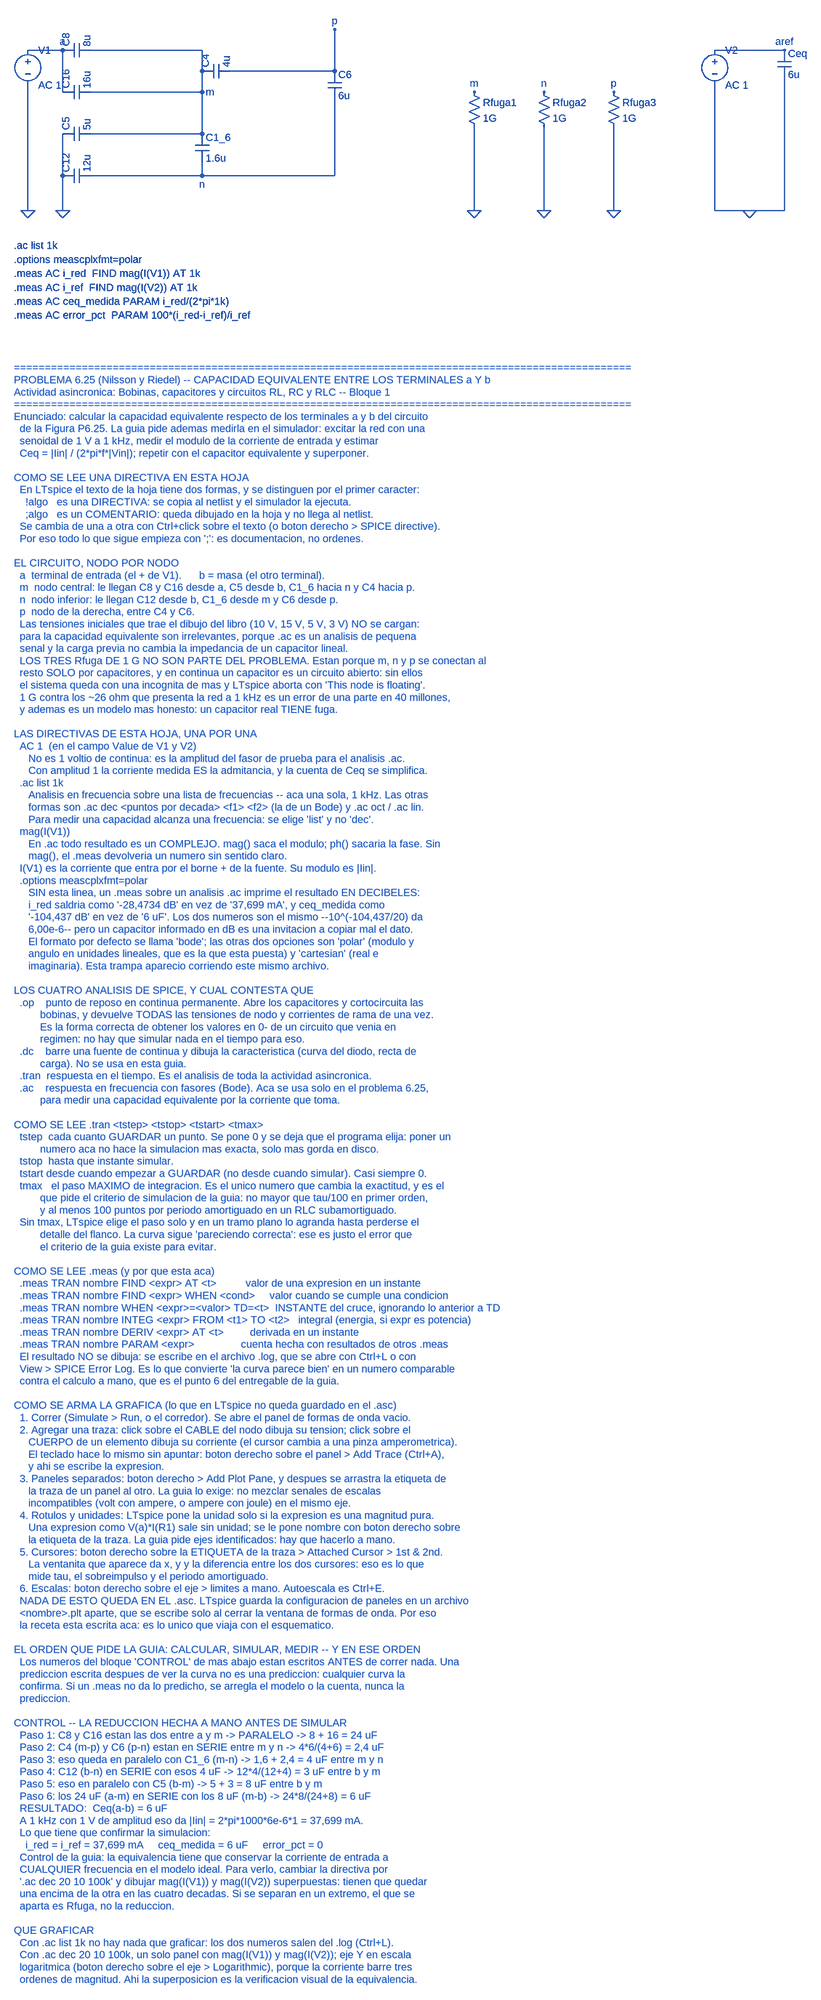
[diagram p0: schematic P6-25_capacidad_equivalente.asc]
P6-25_capacidad_equivalente.asc, the LTspice schematic file:
Version 4
SHEET 1 2400 2800
WIRE 96 112 176 112
WIRE 96 192 96 480
WIRE 240 112 496 112
WIRE 240 208 496 208
WIRE 176 112 176 208
WIRE 240 304 496 304
WIRE 240 400 496 400
WIRE 176 304 176 400
WIRE 176 400 176 480
WIRE 496 112 496 304
WIRE 496 368 496 400
WIRE 560 160 800 160
WIRE 800 224 800 400
WIRE 800 160 800 64
WIRE 800 400 496 400
WIRE 1120 288 1120 480
WIRE 1280 288 1280 480
WIRE 1440 288 1440 480
WIRE 1760 112 1920 112
WIRE 1760 192 1760 480
WIRE 1920 176 1920 480
WIRE 1760 480 1920 480
FLAG 96 480 0
FLAG 176 480 0
FLAG 176 112 a
FLAG 496 208 m
FLAG 496 400 n
FLAG 800 64 p
FLAG 1120 208 m
FLAG 1120 480 0
FLAG 1280 208 n
FLAG 1280 480 0
FLAG 1440 208 p
FLAG 1440 480 0
FLAG 1840 480 0
FLAG 1920 112 aref
SYMBOL voltage 96 96 R0
WINDOW 123 0 0 Left 0
WINDOW 39 0 0 Left 0
SYMATTR InstName V1
SYMATTR Value AC 1
SYMBOL cap 176 128 R270
SYMATTR InstName C8
SYMATTR Value 8u
SYMBOL cap 176 224 R270
SYMATTR InstName C16
SYMATTR Value 16u
SYMBOL cap 176 320 R270
SYMATTR InstName C5
SYMATTR Value 5u
SYMBOL cap 176 416 R270
SYMATTR InstName C12
SYMATTR Value 12u
SYMBOL cap 480 304 R0
SYMATTR InstName C1_6
SYMATTR Value 1.6u
SYMBOL cap 496 176 R270
SYMATTR InstName C4
SYMATTR Value 4u
SYMBOL cap 784 160 R0
SYMATTR InstName C6
SYMATTR Value 6u
SYMBOL res 1104 192 R0
SYMATTR InstName Rfuga1
SYMATTR Value 1G
SYMBOL res 1264 192 R0
SYMATTR InstName Rfuga2
SYMATTR Value 1G
SYMBOL res 1424 192 R0
SYMATTR InstName Rfuga3
SYMATTR Value 1G
SYMBOL voltage 1760 96 R0
WINDOW 123 0 0 Left 0
WINDOW 39 0 0 Left 0
SYMATTR InstName V2
SYMATTR Value AC 1
SYMBOL cap 1904 112 R0
SYMATTR InstName Ceq
SYMATTR Value 6u
TEXT 64 560 Left 2 !.ac list 1k
TEXT 64 592 Left 2 !.options meascplxfmt=polar
TEXT 64 624 Left 2 !.meas AC i_red  FIND mag(I(V1)) AT 1k
TEXT 64 656 Left 2 !.meas AC i_ref  FIND mag(I(V2)) AT 1k
TEXT 64 688 Left 2 !.meas AC ceq_medida PARAM i_red/(2*pi*1k)
TEXT 64 720 Left 2 !.meas AC error_pct  PARAM 100*(i_red-i_ref)/i_ref
TEXT 64 1000 Left 2 ;====================================================================================================
TEXT 64 1028 Left 2 ;PROBLEMA 6.25 (Nilsson y Riedel) -- CAPACIDAD EQUIVALENTE ENTRE LOS TERMINALES a Y b
TEXT 64 1056 Left 2 ;Actividad asincronica: Bobinas, capacitores y circuitos RL, RC y RLC -- Bloque 1
TEXT 64 1084 Left 2 ;====================================================================================================
TEXT 64 1112 Left 2 ;Enunciado: calcular la capacidad equivalente respecto de los terminales a y b del circuito
TEXT 64 1140 Left 2 ;  de la Figura P6.25. La guia pide ademas medirla en el simulador: excitar la red con una
TEXT 64 1168 Left 2 ;  senoidal de 1 V a 1 kHz, medir el modulo de la corriente de entrada y estimar
TEXT 64 1196 Left 2 ;  Ceq = |Iin| / (2*pi*f*|Vin|); repetir con el capacitor equivalente y superponer.
TEXT 64 1224 Left 2 ;
TEXT 64 1252 Left 2 ;COMO SE LEE UNA DIRECTIVA EN ESTA HOJA
TEXT 64 1280 Left 2 ;  En LTspice el texto de la hoja tiene dos formas, y se distinguen por el primer caracter:
TEXT 64 1308 Left 2 ;    !algo   es una DIRECTIVA: se copia al netlist y el simulador la ejecuta.
TEXT 64 1336 Left 2 ;    ;algo   es un COMENTARIO: queda dibujado en la hoja y no llega al netlist.
TEXT 64 1364 Left 2 ;  Se cambia de una a otra con Ctrl+click sobre el texto (o boton derecho > SPICE directive).
TEXT 64 1392 Left 2 ;  Por eso todo lo que sigue empieza con ';': es documentacion, no ordenes.
TEXT 64 1420 Left 2 ;
TEXT 64 1448 Left 2 ;EL CIRCUITO, NODO POR NODO
TEXT 64 1476 Left 2 ;  a  terminal de entrada (el + de V1).      b = masa (el otro terminal).
TEXT 64 1504 Left 2 ;  m  nodo central: le llegan C8 y C16 desde a, C5 desde b, C1_6 hacia n y C4 hacia p.
TEXT 64 1532 Left 2 ;  n  nodo inferior: le llegan C12 desde b, C1_6 desde m y C6 desde p.
TEXT 64 1560 Left 2 ;  p  nodo de la derecha, entre C4 y C6.
TEXT 64 1588 Left 2 ;  Las tensiones iniciales que trae el dibujo del libro (10 V, 15 V, 5 V, 3 V) NO se cargan:
TEXT 64 1616 Left 2 ;  para la capacidad equivalente son irrelevantes, porque .ac es un analisis de pequena
TEXT 64 1644 Left 2 ;  senal y la carga previa no cambia la impedancia de un capacitor lineal.
TEXT 64 1672 Left 2 ;  LOS TRES Rfuga DE 1 G NO SON PARTE DEL PROBLEMA. Estan porque m, n y p se conectan al
TEXT 64 1700 Left 2 ;  resto SOLO por capacitores, y en continua un capacitor es un circuito abierto: sin ellos
TEXT 64 1728 Left 2 ;  el sistema queda con una incognita de mas y LTspice aborta con 'This node is floating'.
TEXT 64 1756 Left 2 ;  1 G contra los ~26 ohm que presenta la red a 1 kHz es un error de una parte en 40 millones,
TEXT 64 1784 Left 2 ;  y ademas es un modelo mas honesto: un capacitor real TIENE fuga.
TEXT 64 1812 Left 2 ;
TEXT 64 1840 Left 2 ;LAS DIRECTIVAS DE ESTA HOJA, UNA POR UNA
TEXT 64 1868 Left 2 ;  AC 1  (en el campo Value de V1 y V2)
TEXT 64 1896 Left 2 ;     No es 1 voltio de continua: es la amplitud del fasor de prueba para el analisis .ac.
TEXT 64 1924 Left 2 ;     Con amplitud 1 la corriente medida ES la admitancia, y la cuenta de Ceq se simplifica.
TEXT 64 1952 Left 2 ;  .ac list 1k
TEXT 64 1980 Left 2 ;     Analisis en frecuencia sobre una lista de frecuencias -- aca una sola, 1 kHz. Las otras
TEXT 64 2008 Left 2 ;     formas son .ac dec <puntos por decada> <f1> <f2> (la de un Bode) y .ac oct / .ac lin.
TEXT 64 2036 Left 2 ;     Para medir una capacidad alcanza una frecuencia: se elige 'list' y no 'dec'.
TEXT 64 2064 Left 2 ;  mag(I(V1))
TEXT 64 2092 Left 2 ;     En .ac todo resultado es un COMPLEJO. mag() saca el modulo; ph() sacaria la fase. Sin
TEXT 64 2120 Left 2 ;     mag(), el .meas devolveria un numero sin sentido claro.
TEXT 64 2148 Left 2 ;  I(V1) es la corriente que entra por el borne + de la fuente. Su modulo es |Iin|.
TEXT 64 2176 Left 2 ;  .options meascplxfmt=polar
TEXT 64 2204 Left 2 ;     SIN esta linea, un .meas sobre un analisis .ac imprime el resultado EN DECIBELES:
TEXT 64 2232 Left 2 ;     i_red saldria como '-28,4734 dB' en vez de '37,699 mA', y ceq_medida como
TEXT 64 2260 Left 2 ;     '-104,437 dB' en vez de '6 uF'. Los dos numeros son el mismo --10^(-104,437/20) da
TEXT 64 2288 Left 2 ;     6,00e-6-- pero un capacitor informado en dB es una invitacion a copiar mal el dato.
TEXT 64 2316 Left 2 ;     El formato por defecto se llama 'bode'; las otras dos opciones son 'polar' (modulo y
TEXT 64 2344 Left 2 ;     angulo en unidades lineales, que es la que esta puesta) y 'cartesian' (real e
TEXT 64 2372 Left 2 ;     imaginaria). Esta trampa aparecio corriendo este mismo archivo.
TEXT 64 2400 Left 2 ;
TEXT 64 2428 Left 2 ;LOS CUATRO ANALISIS DE SPICE, Y CUAL CONTESTA QUE
TEXT 64 2456 Left 2 ;  .op    punto de reposo en continua permanente. Abre los capacitores y cortocircuita las
TEXT 64 2484 Left 2 ;         bobinas, y devuelve TODAS las tensiones de nodo y corrientes de rama de una vez.
TEXT 64 2512 Left 2 ;         Es la forma correcta de obtener los valores en 0- de un circuito que venia en
TEXT 64 2540 Left 2 ;         regimen: no hay que simular nada en el tiempo para eso.
TEXT 64 2568 Left 2 ;  .dc    barre una fuente de continua y dibuja la caracteristica (curva del diodo, recta de
TEXT 64 2596 Left 2 ;         carga). No se usa en esta guia.
TEXT 64 2624 Left 2 ;  .tran  respuesta en el tiempo. Es el analisis de toda la actividad asincronica.
TEXT 64 2652 Left 2 ;  .ac    respuesta en frecuencia con fasores (Bode). Aca se usa solo en el problema 6.25,
TEXT 64 2680 Left 2 ;         para medir una capacidad equivalente por la corriente que toma.
TEXT 64 2708 Left 2 ;
TEXT 64 2736 Left 2 ;COMO SE LEE .tran <tstep> <tstop> <tstart> <tmax>
TEXT 64 2764 Left 2 ;  tstep  cada cuanto GUARDAR un punto. Se pone 0 y se deja que el programa elija: poner un
TEXT 64 2792 Left 2 ;         numero aca no hace la simulacion mas exacta, solo mas gorda en disco.
TEXT 64 2820 Left 2 ;  tstop  hasta que instante simular.
TEXT 64 2848 Left 2 ;  tstart desde cuando empezar a GUARDAR (no desde cuando simular). Casi siempre 0.
TEXT 64 2876 Left 2 ;  tmax   el paso MAXIMO de integracion. Es el unico numero que cambia la exactitud, y es el
TEXT 64 2904 Left 2 ;         que pide el criterio de simulacion de la guia: no mayor que tau/100 en primer orden,
TEXT 64 2932 Left 2 ;         y al menos 100 puntos por periodo amortiguado en un RLC subamortiguado.
TEXT 64 2960 Left 2 ;  Sin tmax, LTspice elige el paso solo y en un tramo plano lo agranda hasta perderse el
TEXT 64 2988 Left 2 ;         detalle del flanco. La curva sigue 'pareciendo correcta': ese es justo el error que
TEXT 64 3016 Left 2 ;         el criterio de la guia existe para evitar.
TEXT 64 3044 Left 2 ;
TEXT 64 3072 Left 2 ;COMO SE LEE .meas (y por que esta aca)
TEXT 64 3100 Left 2 ;  .meas TRAN nombre FIND <expr> AT <t>          valor de una expresion en un instante
TEXT 64 3128 Left 2 ;  .meas TRAN nombre FIND <expr> WHEN <cond>     valor cuando se cumple una condicion
TEXT 64 3156 Left 2 ;  .meas TRAN nombre WHEN <expr>=<valor> TD=<t>  INSTANTE del cruce, ignorando lo anterior a TD
TEXT 64 3184 Left 2 ;  .meas TRAN nombre INTEG <expr> FROM <t1> TO <t2>   integral (energia, si expr es potencia)
TEXT 64 3212 Left 2 ;  .meas TRAN nombre DERIV <expr> AT <t>         derivada en un instante
TEXT 64 3240 Left 2 ;  .meas TRAN nombre PARAM <expr>                cuenta hecha con resultados de otros .meas
TEXT 64 3268 Left 2 ;  El resultado NO se dibuja: se escribe en el archivo .log, que se abre con Ctrl+L o con
TEXT 64 3296 Left 2 ;  View > SPICE Error Log. Es lo que convierte 'la curva parece bien' en un numero comparable
TEXT 64 3324 Left 2 ;  contra el calculo a mano, que es el punto 6 del entregable de la guia.
TEXT 64 3352 Left 2 ;
TEXT 64 3380 Left 2 ;COMO SE ARMA LA GRAFICA (lo que en LTspice no queda guardado en el .asc)
TEXT 64 3408 Left 2 ;  1. Correr (Simulate > Run, o el corredor). Se abre el panel de formas de onda vacio.
TEXT 64 3436 Left 2 ;  2. Agregar una traza: click sobre el CABLE del nodo dibuja su tension; click sobre el
TEXT 64 3464 Left 2 ;     CUERPO de un elemento dibuja su corriente (el cursor cambia a una pinza amperometrica).
TEXT 64 3492 Left 2 ;     El teclado hace lo mismo sin apuntar: boton derecho sobre el panel > Add Trace (Ctrl+A),
TEXT 64 3520 Left 2 ;     y ahi se escribe la expresion.
TEXT 64 3548 Left 2 ;  3. Paneles separados: boton derecho > Add Plot Pane, y despues se arrastra la etiqueta de
TEXT 64 3576 Left 2 ;     la traza de un panel al otro. La guia lo exige: no mezclar senales de escalas
TEXT 64 3604 Left 2 ;     incompatibles (volt con ampere, o ampere con joule) en el mismo eje.
TEXT 64 3632 Left 2 ;  4. Rotulos y unidades: LTspice pone la unidad solo si la expresion es una magnitud pura.
TEXT 64 3660 Left 2 ;     Una expresion como V(a)*I(R1) sale sin unidad; se le pone nombre con boton derecho sobre
TEXT 64 3688 Left 2 ;     la etiqueta de la traza. La guia pide ejes identificados: hay que hacerlo a mano.
TEXT 64 3716 Left 2 ;  5. Cursores: boton derecho sobre la ETIQUETA de la traza > Attached Cursor > 1st & 2nd.
TEXT 64 3744 Left 2 ;     La ventanita que aparece da x, y y la diferencia entre los dos cursores: eso es lo que
TEXT 64 3772 Left 2 ;     mide tau, el sobreimpulso y el periodo amortiguado.
TEXT 64 3800 Left 2 ;  6. Escalas: boton derecho sobre el eje > limites a mano. Autoescala es Ctrl+E.
TEXT 64 3828 Left 2 ;  NADA DE ESTO QUEDA EN EL .asc. LTspice guarda la configuracion de paneles en un archivo
TEXT 64 3856 Left 2 ;  <nombre>.plt aparte, que se escribe solo al cerrar la ventana de formas de onda. Por eso
TEXT 64 3884 Left 2 ;  la receta esta escrita aca: es lo unico que viaja con el esquematico.
TEXT 64 3912 Left 2 ;
TEXT 64 3940 Left 2 ;EL ORDEN QUE PIDE LA GUIA: CALCULAR, SIMULAR, MEDIR -- Y EN ESE ORDEN
TEXT 64 3968 Left 2 ;  Los numeros del bloque 'CONTROL' de mas abajo estan escritos ANTES de correr nada. Una
TEXT 64 3996 Left 2 ;  prediccion escrita despues de ver la curva no es una prediccion: cualquier curva la
TEXT 64 4024 Left 2 ;  confirma. Si un .meas no da lo predicho, se arregla el modelo o la cuenta, nunca la
TEXT 64 4052 Left 2 ;  prediccion.
TEXT 64 4080 Left 2 ;
TEXT 64 4108 Left 2 ;CONTROL -- LA REDUCCION HECHA A MANO ANTES DE SIMULAR
TEXT 64 4136 Left 2 ;  Paso 1: C8 y C16 estan las dos entre a y m -> PARALELO -> 8 + 16 = 24 uF
TEXT 64 4164 Left 2 ;  Paso 2: C4 (m-p) y C6 (p-n) estan en SERIE entre m y n -> 4*6/(4+6) = 2,4 uF
TEXT 64 4192 Left 2 ;  Paso 3: eso queda en paralelo con C1_6 (m-n) -> 1,6 + 2,4 = 4 uF entre m y n
TEXT 64 4220 Left 2 ;  Paso 4: C12 (b-n) en SERIE con esos 4 uF -> 12*4/(12+4) = 3 uF entre b y m
TEXT 64 4248 Left 2 ;  Paso 5: eso en paralelo con C5 (b-m) -> 5 + 3 = 8 uF entre b y m
TEXT 64 4276 Left 2 ;  Paso 6: los 24 uF (a-m) en SERIE con los 8 uF (m-b) -> 24*8/(24+8) = 6 uF
TEXT 64 4304 Left 2 ;  RESULTADO:  Ceq(a-b) = 6 uF
TEXT 64 4332 Left 2 ;  A 1 kHz con 1 V de amplitud eso da |Iin| = 2*pi*1000*6e-6*1 = 37,699 mA.
TEXT 64 4360 Left 2 ;  Lo que tiene que confirmar la simulacion:
TEXT 64 4388 Left 2 ;    i_red = i_ref = 37,699 mA     ceq_medida = 6 uF     error_pct = 0
TEXT 64 4416 Left 2 ;  Control de la guia: la equivalencia tiene que conservar la corriente de entrada a
TEXT 64 4444 Left 2 ;  CUALQUIER frecuencia en el modelo ideal. Para verlo, cambiar la directiva por
TEXT 64 4472 Left 2 ;  '.ac dec 20 10 100k' y dibujar mag(I(V1)) y mag(I(V2)) superpuestas: tienen que quedar
TEXT 64 4500 Left 2 ;  una encima de la otra en las cuatro decadas. Si se separan en un extremo, el que se
TEXT 64 4528 Left 2 ;  aparta es Rfuga, no la reduccion.
TEXT 64 4556 Left 2 ;
TEXT 64 4584 Left 2 ;QUE GRAFICAR
TEXT 64 4612 Left 2 ;  Con .ac list 1k no hay nada que graficar: los dos numeros salen del .log (Ctrl+L).
TEXT 64 4640 Left 2 ;  Con .ac dec 20 10 100k, un solo panel con mag(I(V1)) y mag(I(V2)); eje Y en escala
TEXT 64 4668 Left 2 ;  logaritmica (boton derecho sobre el eje > Logarithmic), porque la corriente barre tres
TEXT 64 4696 Left 2 ;  ordenes de magnitud. Ahi la superposicion es la verificacion visual de la equivalencia.

The netlist it stands for:
* P6-25_capacidad_equivalente.asc
V1 a 0 AC 1
C8 a m 8u
C16 a m 16u
C5 0 m 5u
C12 0 n 12u
C1_6 m n 1.6u
C4 m p 4u
C6 p n 6u
Rfuga1 m 0 1G
Rfuga2 n 0 1G
Rfuga3 p 0 1G
V2 aref 0 AC 1
Ceq aref 0 6u
.ac list 1k
.options meascplxfmt=polar
.meas AC i_red  FIND mag(I(V1)) AT 1k
.meas AC i_ref  FIND mag(I(V2)) AT 1k
.meas AC ceq_medida PARAM i_red/(2*pi*1k)
.meas AC error_pct  PARAM 100*(i_red-i_ref)/i_ref
* ====================================================================================================
* PROBLEMA 6.25 (Nilsson y Riedel) -- CAPACIDAD EQUIVALENTE ENTRE LOS TERMINALES a Y b
* Actividad asincronica: Bobinas, capacitores y circuitos RL, RC y RLC -- Bloque 1
* ====================================================================================================
* Enunciado: calcular la capacidad equivalente respecto de los terminales a y b del circuito
*   de la Figura P6.25. La guia pide ademas medirla en el simulador: excitar la red con una
*   senoidal de 1 V a 1 kHz, medir el modulo de la corriente de entrada y estimar
*   Ceq = |Iin| / (2*pi*f*|Vin|); repetir con el capacitor equivalente y superponer.
* COMO SE LEE UNA DIRECTIVA EN ESTA HOJA
*   En LTspice el texto de la hoja tiene dos formas, y se distinguen por el primer caracter:
*     !algo   es una DIRECTIVA: se copia al netlist y el simulador la ejecuta.
*     ;algo   es un COMENTARIO: queda dibujado en la hoja y no llega al netlist.
*   Se cambia de una a otra con Ctrl+click sobre el texto (o boton derecho > SPICE directive).
*   Por eso todo lo que sigue empieza con ';': es documentacion, no ordenes.
* EL CIRCUITO, NODO POR NODO
*   a  terminal de entrada (el + de V1).      b = masa (el otro terminal).
*   m  nodo central: le llegan C8 y C16 desde a, C5 desde b, C1_6 hacia n y C4 hacia p.
*   n  nodo inferior: le llegan C12 desde b, C1_6 desde m y C6 desde p.
*   p  nodo de la derecha, entre C4 y C6.
*   Las tensiones iniciales que trae el dibujo del libro (10 V, 15 V, 5 V, 3 V) NO se cargan:
*   para la capacidad equivalente son irrelevantes, porque .ac es un analisis de pequena
*   senal y la carga previa no cambia la impedancia de un capacitor lineal.
*   LOS TRES Rfuga DE 1 G NO SON PARTE DEL PROBLEMA. Estan porque m, n y p se conectan al
*   resto SOLO por capacitores, y en continua un capacitor es un circuito abierto: sin ellos
*   el sistema queda con una incognita de mas y LTspice aborta con 'This node is floating'.
*   1 G contra los ~26 ohm que presenta la red a 1 kHz es un error de una parte en 40 millones,
*   y ademas es un modelo mas honesto: un capacitor real TIENE fuga.
* LAS DIRECTIVAS DE ESTA HOJA, UNA POR UNA
*   AC 1  (en el campo Value de V1 y V2)
*      No es 1 voltio de continua: es la amplitud del fasor de prueba para el analisis .ac.
*      Con amplitud 1 la corriente medida ES la admitancia, y la cuenta de Ceq se simplifica.
*   .ac list 1k
*      Analisis en frecuencia sobre una lista de frecuencias -- aca una sola, 1 kHz. Las otras
*      formas son .ac dec <puntos por decada> <f1> <f2> (la de un Bode) y .ac oct / .ac lin.
*      Para medir una capacidad alcanza una frecuencia: se elige 'list' y no 'dec'.
*   mag(I(V1))
*      En .ac todo resultado es un COMPLEJO. mag() saca el modulo; ph() sacaria la fase. Sin
*      mag(), el .meas devolveria un numero sin sentido claro.
*   I(V1) es la corriente que entra por el borne + de la fuente. Su modulo es |Iin|.
*   .options meascplxfmt=polar
*      SIN esta linea, un .meas sobre un analisis .ac imprime el resultado EN DECIBELES:
*      i_red saldria como '-28,4734 dB' en vez de '37,699 mA', y ceq_medida como
*      '-104,437 dB' en vez de '6 uF'. Los dos numeros son el mismo --10^(-104,437/20) da
*      6,00e-6-- pero un capacitor informado en dB es una invitacion a copiar mal el dato.
*      El formato por defecto se llama 'bode'; las otras dos opciones son 'polar' (modulo y
*      angulo en unidades lineales, que es la que esta puesta) y 'cartesian' (real e
*      imaginaria). Esta trampa aparecio corriendo este mismo archivo.
* LOS CUATRO ANALISIS DE SPICE, Y CUAL CONTESTA QUE
*   .op    punto de reposo en continua permanente. Abre los capacitores y cortocircuita las
*          bobinas, y devuelve TODAS las tensiones de nodo y corrientes de rama de una vez.
*          Es la forma correcta de obtener los valores en 0- de un circuito que venia en
*          regimen: no hay que simular nada en el tiempo para eso.
*   .dc    barre una fuente de continua y dibuja la caracteristica (curva del diodo, recta de
*          carga). No se usa en esta guia.
*   .tran  respuesta en el tiempo. Es el analisis de toda la actividad asincronica.
*   .ac    respuesta en frecuencia con fasores (Bode). Aca se usa solo en el problema 6.25,
*          para medir una capacidad equivalente por la corriente que toma.
* COMO SE LEE .tran <tstep> <tstop> <tstart> <tmax>
*   tstep  cada cuanto GUARDAR un punto. Se pone 0 y se deja que el programa elija: poner un
*          numero aca no hace la simulacion mas exacta, solo mas gorda en disco.
*   tstop  hasta que instante simular.
*   tstart desde cuando empezar a GUARDAR (no desde cuando simular). Casi siempre 0.
*   tmax   el paso MAXIMO de integracion. Es el unico numero que cambia la exactitud, y es el
*          que pide el criterio de simulacion de la guia: no mayor que tau/100 en primer orden,
*          y al menos 100 puntos por periodo amortiguado en un RLC subamortiguado.
*   Sin tmax, LTspice elige el paso solo y en un tramo plano lo agranda hasta perderse el
*          detalle del flanco. La curva sigue 'pareciendo correcta': ese es justo el error que
*          el criterio de la guia existe para evitar.
* COMO SE LEE .meas (y por que esta aca)
*   .meas TRAN nombre FIND <expr> AT <t>          valor de una expresion en un instante
*   .meas TRAN nombre FIND <expr> WHEN <cond>     valor cuando se cumple una condicion
*   .meas TRAN nombre WHEN <expr>=<valor> TD=<t>  INSTANTE del cruce, ignorando lo anterior a TD
*   .meas TRAN nombre INTEG <expr> FROM <t1> TO <t2>   integral (energia, si expr es potencia)
*   .meas TRAN nombre DERIV <expr> AT <t>         derivada en un instante
*   .meas TRAN nombre PARAM <expr>                cuenta hecha con resultados de otros .meas
*   El resultado NO se dibuja: se escribe en el archivo .log, que se abre con Ctrl+L o con
*   View > SPICE Error Log. Es lo que convierte 'la curva parece bien' en un numero comparable
*   contra el calculo a mano, que es el punto 6 del entregable de la guia.
* COMO SE ARMA LA GRAFICA (lo que en LTspice no queda guardado en el .asc)
*   1. Correr (Simulate > Run, o el corredor). Se abre el panel de formas de onda vacio.
*   2. Agregar una traza: click sobre el CABLE del nodo dibuja su tension; click sobre el
*      CUERPO de un elemento dibuja su corriente (el cursor cambia a una pinza amperometrica).
*      El teclado hace lo mismo sin apuntar: boton derecho sobre el panel > Add Trace (Ctrl+A),
*      y ahi se escribe la expresion.
*   3. Paneles separados: boton derecho > Add Plot Pane, y despues se arrastra la etiqueta de
*      la traza de un panel al otro. La guia lo exige: no mezclar senales de escalas
*      incompatibles (volt con ampere, o ampere con joule) en el mismo eje.
*   4. Rotulos y unidades: LTspice pone la unidad solo si la expresion es una magnitud pura.
*      Una expresion como V(a)*I(R1) sale sin unidad; se le pone nombre con boton derecho sobre
*      la etiqueta de la traza. La guia pide ejes identificados: hay que hacerlo a mano.
*   5. Cursores: boton derecho sobre la ETIQUETA de la traza > Attached Cursor > 1st & 2nd.
*      La ventanita que aparece da x, y y la diferencia entre los dos cursores: eso es lo que
*      mide tau, el sobreimpulso y el periodo amortiguado.
*   6. Escalas: boton derecho sobre el eje > limites a mano. Autoescala es Ctrl+E.
*   NADA DE ESTO QUEDA EN EL .asc. LTspice guarda la configuracion de paneles en un archivo
*   <nombre>.plt aparte, que se escribe solo al cerrar la ventana de formas de onda. Por eso
*   la receta esta escrita aca: es lo unico que viaja con el esquematico.
* EL ORDEN QUE PIDE LA GUIA: CALCULAR, SIMULAR, MEDIR -- Y EN ESE ORDEN
*   Los numeros del bloque 'CONTROL' de mas abajo estan escritos ANTES de correr nada. Una
*   prediccion escrita despues de ver la curva no es una prediccion: cualquier curva la
*   confirma. Si un .meas no da lo predicho, se arregla el modelo o la cuenta, nunca la
*   prediccion.
* CONTROL -- LA REDUCCION HECHA A MANO ANTES DE SIMULAR
*   Paso 1: C8 y C16 estan las dos entre a y m -> PARALELO -> 8 + 16 = 24 uF
*   Paso 2: C4 (m-p) y C6 (p-n) estan en SERIE entre m y n -> 4*6/(4+6) = 2,4 uF
*   Paso 3: eso queda en paralelo con C1_6 (m-n) -> 1,6 + 2,4 = 4 uF entre m y n
*   Paso 4: C12 (b-n) en SERIE con esos 4 uF -> 12*4/(12+4) = 3 uF entre b y m
*   Paso 5: eso en paralelo con C5 (b-m) -> 5 + 3 = 8 uF entre b y m
*   Paso 6: los 24 uF (a-m) en SERIE con los 8 uF (m-b) -> 24*8/(24+8) = 6 uF
*   RESULTADO:  Ceq(a-b) = 6 uF
*   A 1 kHz con 1 V de amplitud eso da |Iin| = 2*pi*1000*6e-6*1 = 37,699 mA.
*   Lo que tiene que confirmar la simulacion:
*     i_red = i_ref = 37,699 mA     ceq_medida = 6 uF     error_pct = 0
*   Control de la guia: la equivalencia tiene que conservar la corriente de entrada a
*   CUALQUIER frecuencia en el modelo ideal. Para verlo, cambiar la directiva por
*   '.ac dec 20 10 100k' y dibujar mag(I(V1)) y mag(I(V2)) superpuestas: tienen que quedar
*   una encima de la otra en las cuatro decadas. Si se separan en un extremo, el que se
*   aparta es Rfuga, no la reduccion.
* QUE GRAFICAR
*   Con .ac list 1k no hay nada que graficar: los dos numeros salen del .log (Ctrl+L).
*   Con .ac dec 20 10 100k, un solo panel con mag(I(V1)) y mag(I(V2)); eje Y en escala
*   logaritmica (boton derecho sobre el eje > Logarithmic), porque la corriente barre tres
*   ordenes de magnitud. Ahi la superposicion es la verificacion visual de la equivalencia.
.backanno
.end